# Altium schematic sheet Sheet2.SchDoc
size 420 x 297 mm; Address1: Address1; Address2: Address2; Address3: Address3; Address4: Address4; DocumentNumber: АБВГ.123456.001 Э3; SheetNumber: 1; Scale: 1:1; DocumentType: Схема электрическая принципиальная; FirstReferrence: АБВГ.123456.001
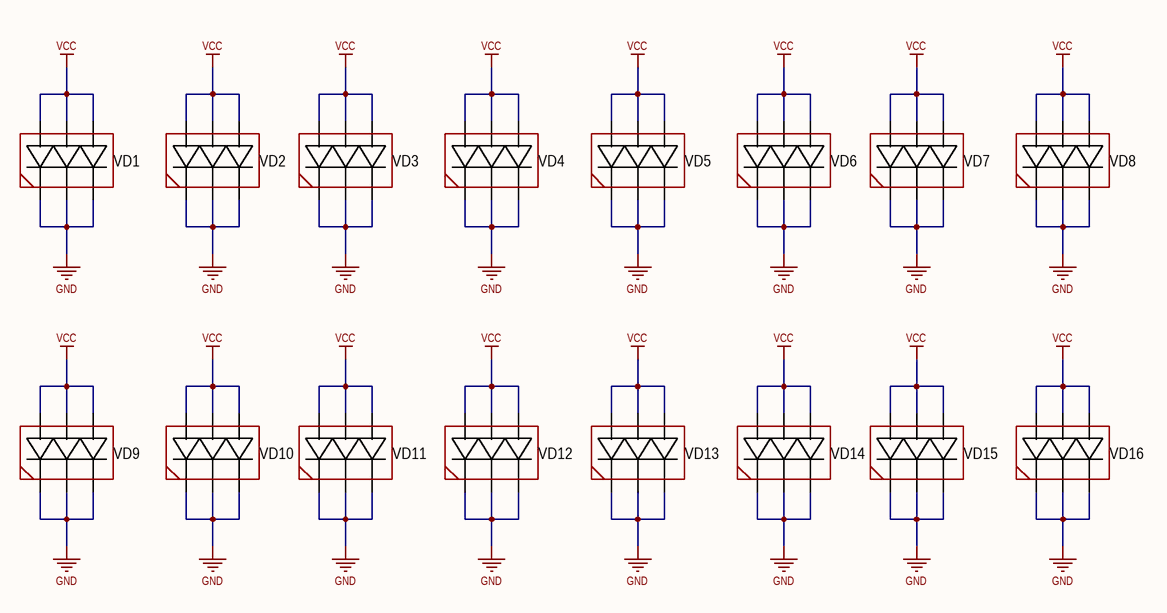
[diagram p0: Sheet2.SchDoc]

## Parts
VD1  (no value)  [LED 5050]
VD2  (no value)  [LED 5050]
VD3  (no value)  [LED 5050]
VD4  (no value)  [LED 5050]
VD5  (no value)  [LED 5050]
VD6  (no value)  [LED 5050]
VD7  (no value)  [LED 5050]
VD8  (no value)  [LED 5050]
VD9  (no value)  [LED 5050]
VD10  (no value)  [LED 5050]
VD11  (no value)  [LED 5050]
VD12  (no value)  [LED 5050]
VD13  (no value)  [LED 5050]
VD14  (no value)  [LED 5050]
VD15  (no value)  [LED 5050]
VD16  (no value)  [LED 5050]

## Nets
GND: VD1.1 VD1.3 VD1.5 VD2.1 VD2.3 VD2.5 VD3.1 VD3.3 VD3.5 VD4.1 VD4.3 VD4.5 VD5.1 VD5.3 VD5.5 VD6.1 VD6.3 VD6.5 VD7.1 VD7.3 VD7.5 VD8.1 VD8.3 VD8.5 VD9.1 VD9.3 VD9.5 VD10.1 VD10.3 VD10.5 VD11.1 VD11.3 VD11.5 VD12.1 VD12.3 VD12.5 VD13.1 VD13.3 VD13.5 VD14.1 VD14.3 VD14.5 VD15.1 VD15.3 VD15.5 VD16.1 VD16.3 VD16.5
VCC: VD1.2 VD1.4 VD1.6 VD2.2 VD2.4 VD2.6 VD3.2 VD3.4 VD3.6 VD4.2 VD4.4 VD4.6 VD5.2 VD5.4 VD5.6 VD6.2 VD6.4 VD6.6 VD7.2 VD7.4 VD7.6 VD8.2 VD8.4 VD8.6 VD9.2 VD9.4 VD9.6 VD10.2 VD10.4 VD10.6 VD11.2 VD11.4 VD11.6 VD12.2 VD12.4 VD12.6 VD13.2 VD13.4 VD13.6 VD14.2 VD14.4 VD14.6 VD15.2 VD15.4 VD15.6 VD16.2 VD16.4 VD16.6

## Notes on the sheet
- Перв. примен.
- Справ. №
- Подп. и дата
- Инв. № дубл.
- Взам. инв. №
- Разраб.
- Изм.
- Лист
- № докум.
- Подп.
- Дата
- Лит.
- Масса
- Масштаб
- Пров.
- Т.контр.
- Листов
- Инв. № подл.
- Утв.
- Н.контр.
- 2.106-A3
- Копировал
- Формат А3

## Library data of the parts
VD1-VD16 = LED 5050: TypeDiode: LED; Manufacturer: *; Package: *; HelpURL: *; ValueManufacturerPartNumber: =TypeDiode+', '+ColorParameter+', '+Current+', '+VoltageDrop+', '+Package+', '+Temperature; Temperature: -55...+150°C; Current: *; VoltageDrop: *; PartNumber: *